# EAGLE design avr-nrf (EAGLE 6.1)
Assembly variants: no-eth
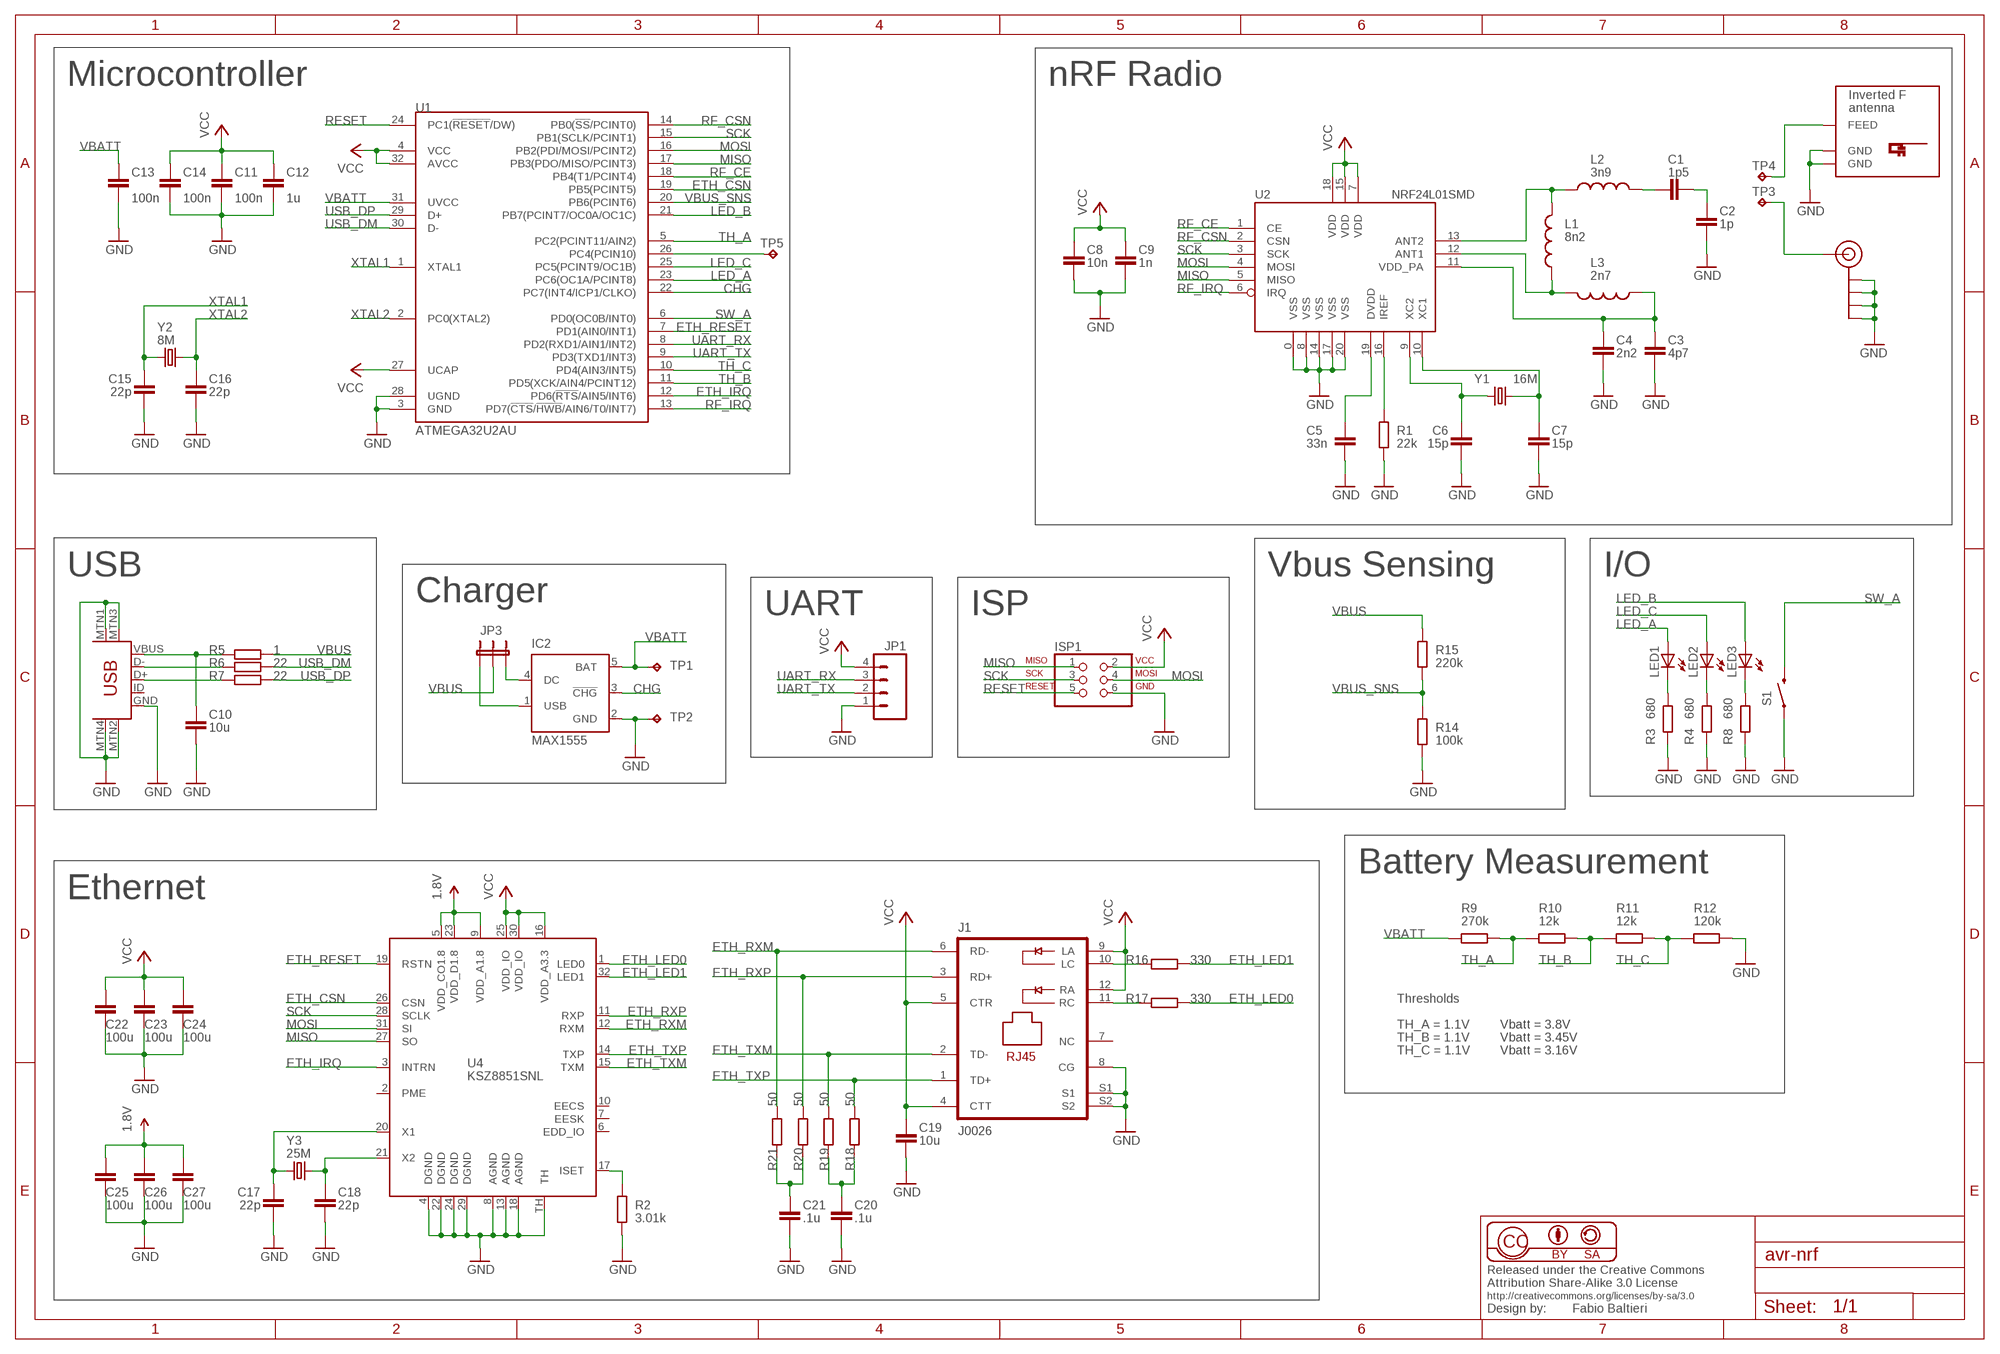
[diagram p0: schematic, sheet 1]

## Parts
C1  1p5  C-EUC0805  [C0805]
C2  1p  C-EUC0805  [C0805]
C3  4p7  C-EUC0805  [C0805]
C4  2n2  C-EUC0805  [C0805]
C5  33n  C-EUC0805  [C0805]
C6  15p  C-EUC0805  [C0805]
C7  15p  C-EUC0805  [C0805]
C8  10n  C-EUC0805  [C0805]
C9  1n  C-EUC0805  [C0805]
C10  10u  C-EUC0805  [C0805]
C11  100n  C-EUC0805  [C0805]
C12  1u  C-EUC0805  [C0805]
C13  100n  C-EUC0805  [C0805]
C14  100n  C-EUC0805  [C0805]
C15  22p  C-EUC0805  [C0805]
C16  22p  C-EUC0805  [C0805]
C17  22p  C-EUC0805  [C0805]  (not fitted in variant no-eth)
C18  22p  C-EUC0805  [C0805]  (not fitted in variant no-eth)
C19  10u  C-EUC0805  [C0805]  (not fitted in variant no-eth)
C20  .1u  C-EUC0805  [C0805]  (not fitted in variant no-eth)
C21  .1u  C-EUC0805  [C0805]  (not fitted in variant no-eth)
C22  100u  C-EUC0805  [C0805]  (not fitted in variant no-eth)
C23  100u  C-EUC0805  [C0805]  (not fitted in variant no-eth)
C24  100u  C-EUC0805  [C0805]  (not fitted in variant no-eth)
C25  100u  C-EUC0805  [C0805]  (not fitted in variant no-eth)
C26  100u  C-EUC0805  [C0805]  (not fitted in variant no-eth)
C27  100u  C-EUC0805  [C0805]  (not fitted in variant no-eth)
IC2  MAX1555  [SOT23-5L]
ISP1  ISP-AVR910PTH  [2X03]
J1  J0026  [PJ-J0]  (not fitted in variant no-eth)
J$1  SMA_EDGE  [SMA-EDGE]
JP1  M04PTH  [1X04]
JP3  JUMPER-3SMD  [SJ_3]
L1  8n2  INDUCTOR0603  [0603]
L2  3n9  INDUCTOR0603  [0603]
L3  2n7  INDUCTOR0603  [0603]
LED1  LEDCHIPLED_0805  [CHIPLED_0805]
LED2  LEDCHIPLED_0805  [CHIPLED_0805]
LED3  LEDCHIPLED_0805  [CHIPLED_0805]
R1  22k  R-EU_R0603  [R0603]
R2  3.01k  R-EU_R0603  [R0603]  (not fitted in variant no-eth)
R3  680  R-EU_R0603  [R0603]
R4  680  R-EU_R0603  [R0603]
R5  1  R-EU_R0603  [R0603]
R6  22  R-EU_R0603  [R0603]
R7  22  R-EU_R0603  [R0603]
R8  680  R-EU_R0603  [R0603]
R9  270k  R-EU_R0603  [R0603]
R10  12k  R-EU_R0603  [R0603]
R11  12k  R-EU_R0603  [R0603]
R12  120k  R-EU_R0603  [R0603]
R14  100k  R-EU_R0603  [R0603]
R15  220k  R-EU_R0603  [R0603]
R16  330  R-EU_R0603  [R0603]  (not fitted in variant no-eth)
R17  330  R-EU_R0603  [R0603]  (not fitted in variant no-eth)
R18  50  R-EU_R0603  [R0603]  (not fitted in variant no-eth)
R19  50  R-EU_R0603  [R0603]  (not fitted in variant no-eth)
R20  50  R-EU_R0603  [R0603]  (not fitted in variant no-eth)
R21  50  R-EU_R0603  [R0603]  (not fitted in variant no-eth)
S1  SWITCH-MOMENTARY-2SMD  [TACTILE_SWITCH_SMD]
TP1  TPTP12R  [TP12R]
TP2  TPTP12R  [TP12R]
TP3  TPTP08SQ  [TP08SQ]
TP4  TPTP08SQ  [TP08SQ]
TP5  TPTP06R  [TP06R]
U1  ATMEGA32U2AU  [TQFP32-08]
U2  NRF24L01SMD  [QFN20]
U3  USB-MINIB-5PIN  [USB-MINIB]
U4  KSZ8851SNL  [MLF32-TH]  (not fitted in variant no-eth)
U$1  INVERTED_F_ANTENNA+5  [DN007+5]
Y1  16M  CRYSTAL5X3  [CRYSTAL-SMD-5X3]
Y2  8M  CRYSTAL5X3  [CRYSTAL-SMD-5X3]
Y3  25M  CRYSTAL5X3  [CRYSTAL-SMD-5X3]  (not fitted in variant no-eth)

## Nets
1.8V [power]: C25.1 C26.1 C27.1 U4.5(VDD_CO1.8) U4.9(VDD_A1.8) U4.23(VDD_D1.8)
CHG: IC2.3(!CHG) U1.22(PC7(INT4/ICP1/CLKO))
ETH_CSN: U1.19(PB5(PCINT5)) U4.26(CSN)
ETH_IRQ: U1.12(PD6(!RTS!/AIN5/INT6)) U4.3(INTRN)
ETH_LED0: R17.2 U4.1(LED0)
ETH_LED1: R16.2 U4.32(LED1)
ETH_RESET: U1.7(PD1(AIN0/INT1)) U4.19(RSTN)
ETH_RXM: J1.6(RD-) R21.2 U4.12(RXM)
ETH_RXP: J1.3(RD+) R20.2 U4.11(RXP)
ETH_TXM: J1.2(TD-) R19.2 U4.15(TXM)
ETH_TXP: J1.1(TD+) R18.2 U4.14(TXP)
GND: C2.2 C3.2 C4.2 C5.2 C6.2 C7.2 C8.2 C9.2 C10.2 C11.2 C12.2 C13.2 C14.2 C15.2 C16.2 C17.2 C18.2 C19.2 C20.2 C21.2 C22.2 C23.2 C24.2 C25.2 C26.2 C27.2 IC2.2(GND) ISP1.6 J1.8(CG) J1.S1 J1.S2 J$1.GND@0(GND) J$1.GND@1(GND) J$1.GND@2(GND) J$1.GND@3(GND) JP1.1 R1.2 R2.2 R3.2 R4.2 R8.2 R12.1 R14.2 S1.1 TP2.TP U1.3(GND) U1.28(UGND) U2.0(VSS) U2.8(VSS) U2.14(VSS) U2.17(VSS) U2.20(VSS) U3.GND U3.MTN1(MTN2) U3.MTN2(MTN3) U3.MTN3(MTN1) U3.MTN4 U4.4(DGND) U4.8(AGND) U4.13(AGND) U4.18(AGND) U4.22(DGND) U4.24(DGND) U4.29(DGND) U4.TH U$1.GND U$1.GND@1(GND)
LED_A: LED1.A U1.23(PC6(OC1A/PCINT8))
LED_B: LED3.A U1.21(PB7(PCINT7/OC0A/OC1C))
LED_C: LED2.A U1.25(PC5(PCINT9/OC1B))
MISO: ISP1.1 U1.17(PB3(PDO/MISO/PCINT3)) U2.5(MISO) U4.27(SO)
MOSI: ISP1.4 U1.16(PB2(PDI/MOSI/PCINT2)) U2.4(MOSI) U4.31(SI)
N$1: L1.2 L3.2 U2.12(ANT1)
N$2: L1.1 L2.1 U2.13(ANT2)
N$3: C1.1 L2.2
N$4: C1.2 C2.1
N$5: C3.1 C4.1 L3.1 U2.11(VDD_PA)
N$6: J$1.SIG(SIGNAL) TP3.TP
N$7: C5.1 U2.19(DVDD)
N$8: R1.1 U2.16(IREF)
N$9: C7.1 U2.10(XC1) Y1.3
N$10: C6.1 U2.9(XC2) Y1.1
N$11: TP4.TP U$1.FEED
N$12: IC2.4(DC) JP3.3
N$13: R7.1 U3.D+
N$14: R6.1 U3.D-
N$15: LED1.C R3.1
N$16: IC2.1(USB) JP3.1
N$18: LED2.C R4.1
N$19: LED3.C R8.1
N$20: J1.10(LC) R16.1
N$21: J1.11(RC) R17.1
N$22: R2.1 U4.17(ISET)
N$23: C17.1 U4.20(X1) Y3.1
N$24: C18.1 U4.21(X2) Y3.3
N$25: TP5.TP U1.26(PC4(PCIN10))
N$26: C21.1 R20.1 R21.1
N$27: C20.1 R18.1 R19.1
N$30: C10.1 R5.1 U3.VBUS
RESET: ISP1.5 U1.24(PC1(!RESET!/DW))
RF_CE: U1.18(PB4(T1/PCINT4)) U2.1(CE)
RF_CSN: U1.14(PB0(!SS!/PCINT0)) U2.2(CSN)
RF_IRQ: U1.13(PD7(!CTS!/!HWB!/AIN6/T0/INT7)) U2.6(IRQ)
SCK: ISP1.3 U1.15(PB1(SCLK/PCINT1)) U2.3(SCK) U4.28(SCLK)
SW_A: S1.3 U1.6(PD0(OC0B/INT0))
TH_A: R9.1 R10.2 U1.5(PC2(PCINT11/AIN2))
TH_B: R10.1 R11.2 U1.11(PD5(XCK/AIN4/PCINT12))
TH_C: R11.1 R12.2 U1.10(PD4(AIN3/INT5))
UART_RX: JP1.3 U1.8(PD2(RXD1/AIN1/INT2))
UART_TX: JP1.2 U1.9(PD3(TXD1/INT3))
USB_DM: R6.2 U1.30(D-)
USB_DP: R7.2 U1.29(D+)
VBATT: C13.1 IC2.5(BAT) R9.2 TP1.TP U1.31(UVCC)
VBUS: JP3.2 R5.2 R15.1
VBUS_SNS: R14.1 R15.2 U1.20(PB6(PCINT6))
VCC [power]: C8.1 C9.1 C11.1 C12.1 C14.1 C19.1 C22.1 C23.1 C24.1 ISP1.2 J1.4(CTT) J1.5(CTR) J1.9(LA) J1.12(RA) JP1.4 U1.4(VCC) U1.27(UCAP) U1.32(AVCC) U2.7(VDD) U2.15(VDD) U2.18(VDD) U4.16(VDD_A3.3) U4.25(VDD_IO) U4.30(VDD_IO)
XTAL1: C15.1 U1.1(XTAL1) Y2.1
XTAL2: C16.1 U1.2(PC0(XTAL2)) Y2.3
Unconnected: J1.7(NC) U3.ID U4.2(PME) U4.6(EDD_IO) U4.7(EESK) U4.10(EECS)

## Notes on the sheet
- Microcontroller | nRF Radio
- USB | Vbus Sensing | I/O
- Charger
- UART | ISP
- Battery Measurement
- Ethernet
- Thresholds
- TH_A = 1.1V | Vbatt = 3.8V
- TH_B = 1.1V | Vbatt = 3.45V
- TH_C = 1.1V | Vbatt = 3.16V

## Library data of the parts
C1-C27 = rcl:C-EU: CAPACITOR, European symbol
IC2 = maxim:MAX1555: Dual-Input USB/AC Adapter 1-Cell Li+ Battery Chargers Source: http://www.maxim-ic.com .. MAX1551-MAX1555.pdf
ISP1 = balto:ISP-AVR910: PIN HEADER
J1 = micrel:J0026: RJ45 PulseJack w/LEDs
J$1 = SparkFun:SMA_EDGE: SMA Antenna Connector End launch SMA connector. The paste layer has been removed so that the connector can be hand soldered onto the board after reflow.
JP1 = SparkFun:M04: Header 4 Standard 4-pin 0.1" header. Use with straight break away headers (SKU : PRT-00116), right angle break away headers (PRT-00553), swiss pins (PRT-00743), machine pins (PRT-00117), and female headers (PRT-00115). Molex polarized connector foot print use with SKU : PRT-08231 with associated crimp pins and housings. 1MM SMD Version SKU: PRT-10208
JP3 = SparkFun:JUMPER-3
L1-L3 = SparkFun:INDUCTOR: Inductors Basic Inductor/Choke - 0603 and 1206. Footprints are not proven and vary greatly between part numbers.
LED1-LED3 = led:LED: LED OSRAM: - CHIPLED LG R971, LG N971, LY N971, LG Q971, LY Q971, LO R971, LY R971 LH N974, LH R974 LS Q976, LO Q976, LY Q976 LO Q996 - Hyper CHIPLED LW Q18S LB Q993, LB Q99A, LB R99A - SideLED LS A670, LO A670, LY A670, LG A670, LP A670 LB A673, LV A673, LT A673, LW A673 LH A674 LY A675 LS A676, LA A676, LO A676, LY A676, LW A676 LS A679, LY A679, LG A679 - Hyper Micro SIDELED® LS Y876, LA Y876, LO Y876, LY Y876 LT Y87S - SmartLED LW L88C, LW L88S LB L89C, LB L89S, LG L890 LS L89K, LO L89K, LY L89K LS L896, LA L896, LO L896, LY L896 - TOPLED LS T670, LO T670, LY T670, LG T670, LP T670 LSG T670, LSP T670, LSY T670, LOP T670, LYG T670 LG T671, LOG T671, LSG T671 LB T673, LV T673, LT T673, LW T673 LH T674 LS T676, LA T676, LO T676, LY T676, LB T676, LH T676, LSB T676, LW T676 LB T67C, LV T67C, LT T67C, LS T67K, LO T67K, LY T67K, LW E67C LS E67B, LA E67B, LO E67B, LY E67B, LB E67C, LV E67C, LT E67C LW T67C LS T679, LY T679, LG T679 LS T770, LO T770, LY T770, LG T770, LP T770 LB T773, LV T773, LT T773, LW T773 LH T774 LS E675, LA E675, LY E675, LS T675 LS T776, LA T776, LO T776, LY T776, LB T776 LHGB T686 LT T68C, LB T68C - Hyper Mini TOPLED® LB M676 - Mini TOPLED Santana® LG M470 LS M47K, LO M47K, LY M47K Source: http://www.osram.convergy.de LUXEON: - LUMILED® LXK2-PW12-R00, LXK2-PW12-S00, LXK2-PW14-U00, LXK2-PW14-V00 LXK2-PM12-R00, LXK2-PM12-S00, LXK2-PM14-U00 LXK2-PE12-Q00, LXK2-PE12-R00, LXK2-PE12-S00, LXK2-PE14-T00, LXK2-PE14-U00 LXK2-PB12-K00, LXK2-PB12-L00, LXK2-PB12-M00, LXK2-PB14-N00, LXK2-PB14-P00, LXK2-PB14-Q00 LXK2-PR12-L00, LXK2-PR12-M00, LXK2-PR14-Q00, LXK2-PR14-R00 LXK2-PD12-Q00, LXK2-PD12-R00, LXK2-PD12-S00 LXK2-PH12-R00, LXK2-PH12-S00 LXK2-PL12-P00, LXK2-PL12-Q00, LXK2-PL12-R00 Source: www.luxeon.com KINGBRIGHT: KA-3528ASYC Source: www.kingbright.com
R1-R12 R14-R21 = rcl:R-EU_: RESISTOR, European symbol
S1 = SparkFun:SWITCH-MOMENTARY-2
TP1-TP5 = testpad:TP: Test pad
U1 = balto:ATMEGA32U2: Atmel 8-bit Microcontroller with 8/16/32K Bystes of ISP Flash and USB Controller. ATmega8U2, ATmega16U2, and ATmega32U2
U2 = SparkFun:NRF24L01: 2.4GHz Low Power Transceiver This is the very popular, low cost, very low power RF transceiver from Nordic Semiconductor. Simple SPI interface. SKU: COM-00690
U3 = SparkFun:USB-MINIB: Mini-USB "B" connector with 5th pin broken out. Created new symbol breaking out 5th "ID" pin in mini/micro USB connector spec. See: http://en.wikipedia.org/wiki/Mini_usb#Cables. Uses same footprint as 4-pin symbol. Also added pins to connect to mounting / shield pads if required (probably not generally needed as signals aren't shielded once they leave the connector).
U4 = balto:KSZ8851SNL: KSZ8851SNL/SNLI
U$1 = antenna:INVERTED_F_ANTENNA: 2.4GHz Inverted F Antenna Based on TI Design Note DN007
Y1-Y3 = SparkFun:CRYSTAL: Crystals Various standard crystals. Proven footprints. Spark Fun Electronics SKU : COM-00534

## Net classes
1 power: width 0.254 mm

## Board
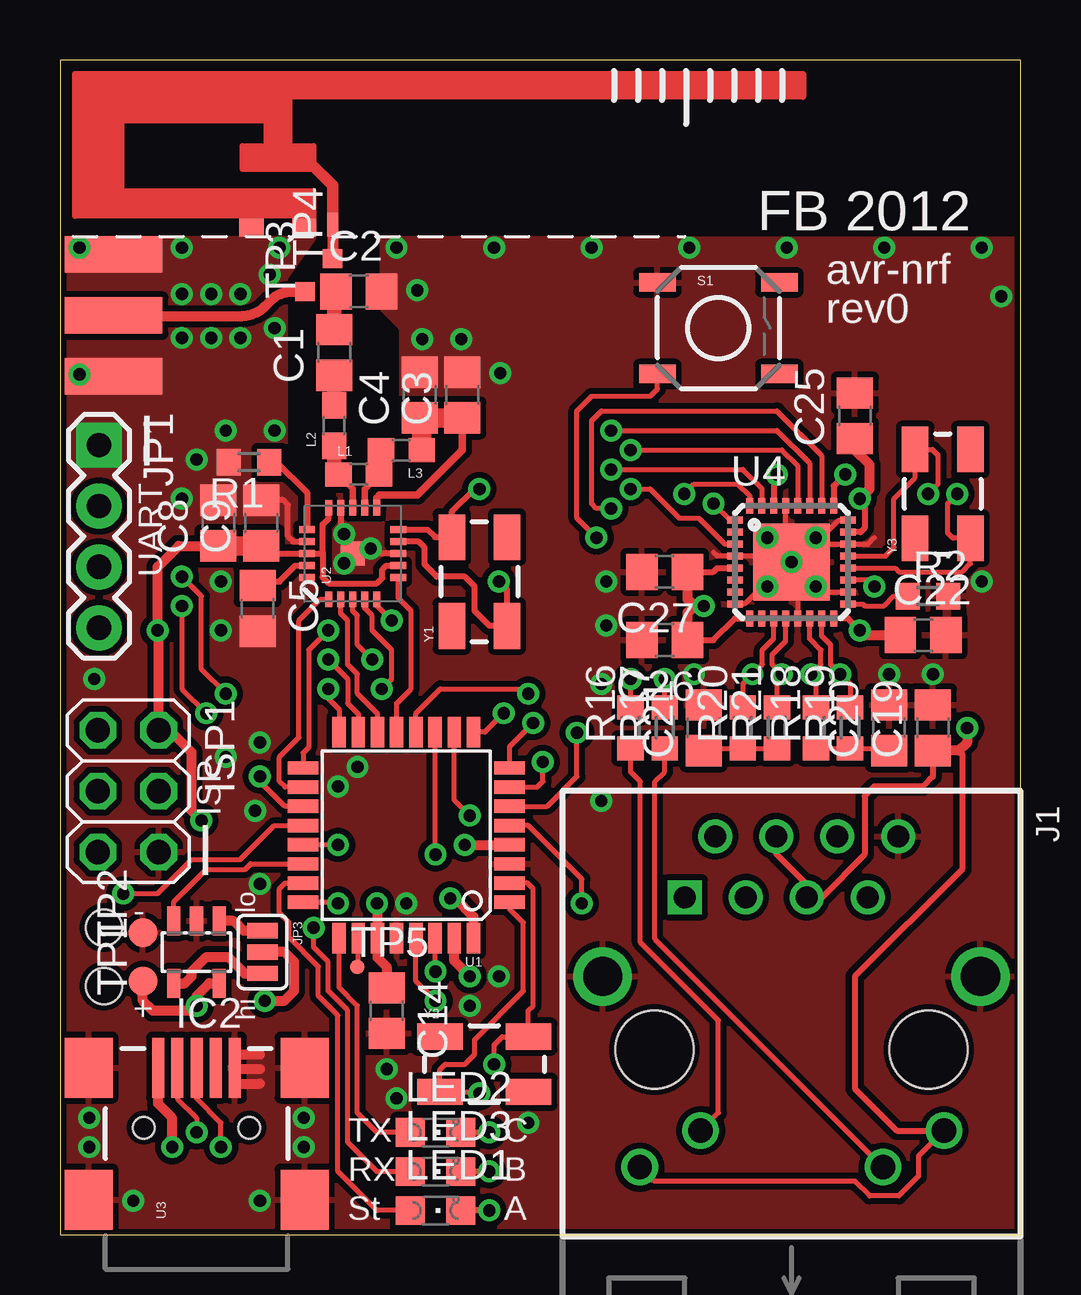
[diagram p1: board, top side]
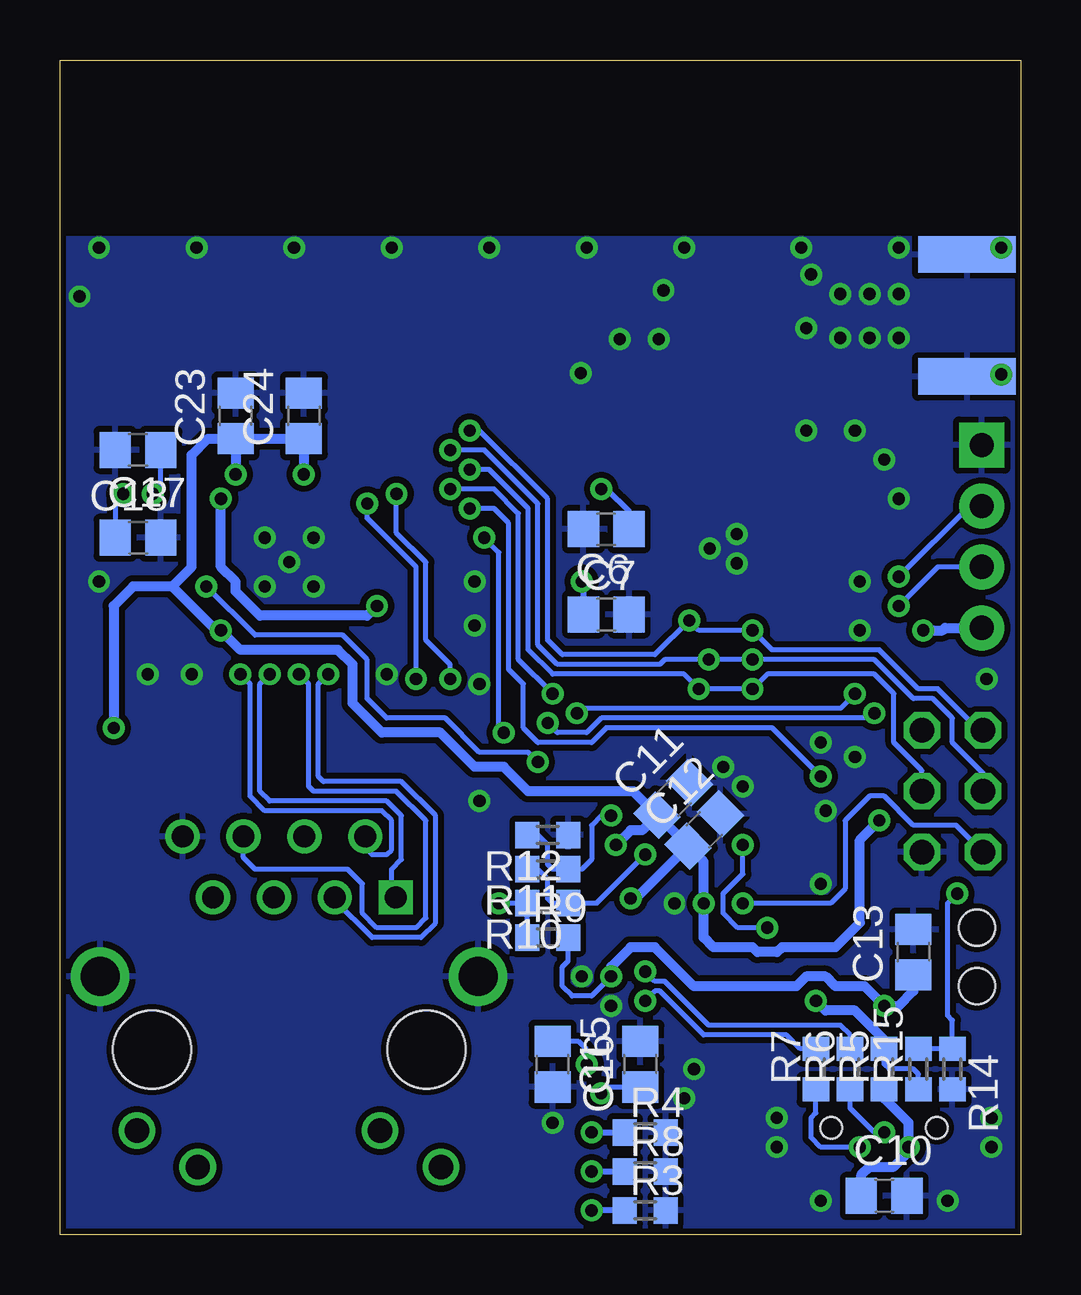
[diagram p2: board, bottom side, seen from below]

Size 40.03 x 48.97 mm. Coordinates in mm from the lower left corner, seen from the top.
Outline: 40.03,0 40.03,48.97 0,48.97 0,0 40.03,0
Copper layers (1*16): Top 0.035mm / dielectric 1.5mm / Bottom 0.035mm
Design rules: minimum track width 8mil, minimum drill 20mil, track to track 8mil, track to pad 8mil, pad to pad 8mil, via to via 8mil, smd to smd 8mil, copper to edge 10mil, drill to drill 8mil, minimum pad ring 10mil, minimum via ring 8mil, stop-mask expansion 4mil, vias tented up to drill 20mil, thermal gap 10mil
Holes 1.5 mm at 1.83,12.8 1.83,10.36

### Footprints (pad centres in the part's own frame; a part is rotated, then mirrored left to right if it is on the bottom)
C0805 = smd 1.3 x 1.5: 1 -0.95,0; 2 0.95,0
SOT23-5L = smd 0.55 x 1.2: 1 -0.95,-1.3; 2 0,-1.3; 3 0.95,-1.3; 4 0.95,1.3; 5 -0.95,1.3
2X03 = drill 1.016 octagon: 1 -2.54,-1.27; 2 -2.54,1.27; 3 0,-1.27; 4 0,1.27; 5 2.54,-1.27; 6 2.54,1.27
PJ-J0 = drill 0.914 square: 1 4.445,-6.35 | drill 0.914: 2 3.175,-8.89; 3 1.905,-6.35; 4 0.635,-8.89; 5 -0.635,-6.35; 6 -1.905,-8.89; 7 -3.175,-6.35; 8 -4.445,-8.89 | drill 1.016: 9 6.325,4.902; 10 3.785,3.378; 11 -3.81,4.902; 12 -6.35,3.378 | drill 1.626: S1 -7.874,-3.048; S2 7.874,-3.048 | hole 3.251: -5.715,0; 5.715,0
SMA-EDGE = smd 1.524 x 4.064: GND@0 0,0; GND@1 5.08,0; SIG 2.54,0 | smd 1.524 x 4.064 bottom: GND@2 0,0; GND@3 5.08,0
1X04 = drill 1.016 pad 1.88 square: 1 0,0 | drill 1.016 pad 1.88: 2 2.54,0; 3 5.08,0; 4 7.62,0
SJ_3 = smd 0.635 x 1.27: 1 -0.889,0; 2 0,0; 3 0.889,0
0603 = smd 1.1 x 1: 1 -0.85,0; 2 0.85,0
CHIPLED_0805 = smd 1.2 x 1.2: A 0,-1.05; C 0,1.05
R0603 = smd 1 x 1.1: 1 -0.85,0; 2 0.85,0
TACTILE_SWITCH_SMD = smd 1.524 x 0.762: 1 -2.54,1.905; 2 2.54,1.905; 3 -2.54,-1.905; 4 2.54,-1.905
TP12R = smd 1.2 x 1.2: TP 0,0
TP08SQ = smd 0.8 x 0.8: TP 0,0
TP06R = smd 0.6 x 0.6: TP 0,0
TQFP32-08 = smd 1.27 x 0.559: 1 -4.293,2.8; 2 -4.293,2; 3 -4.293,1.2; 4 -4.293,0.4; 5 -4.293,-0.4; 6 -4.293,-1.2; 7 -4.293,-2; 8 -4.293,-2.8; 17 4.293,-2.8; 18 4.293,-2; 19 4.293,-1.2; 20 4.293,-0.4; 21 4.293,0.4; 22 4.293,1.2; 23 4.293,2; 24 4.293,2.8 | smd 0.559 x 1.27: 9 -2.8,-4.293; 10 -2,-4.293; 11 -1.2,-4.293; 12 -0.4,-4.293; 13 0.4,-4.293; 14 1.2,-4.293; 15 2,-4.293; 16 2.8,-4.293; 25 2.8,4.293; 26 2,4.293; 27 1.2,4.293; 28 0.4,4.293; 29 -0.4,4.293; 30 -1.2,4.293; 31 -2,4.293; 32 -2.8,4.293
QFN20 = smd 1 x 1: 0 0,0 | smd 0.65 x 0.29: 1 -1.9,1; 2 -1.9,0.5; 3 -1.9,0; 4 -1.9,-0.5; 5 -1.9,-1; 11 1.9,-1; 12 1.9,-0.5; 13 1.9,0; 14 1.9,0.5; 15 1.9,1 | smd 0.29 x 0.65: 6 -1,-1.9; 7 -0.5,-1.9; 8 0,-1.9; 9 0.5,-1.9; 10 1,-1.9; 16 1,1.9; 17 0.5,1.9; 18 0,1.9; 19 -0.5,1.9; 20 -1,1.9
USB-MINIB = smd 2.5 x 0.5: D+ 2.5,0; D- 2.5,0.8; GND 2.5,-1.6; ID 2.5,-0.8; VBUS 2.5,1.6 | smd 2.5 x 2: MTN1 -3,4.5; MTN2 2.5,4.5; MTN3 -3,-4.5; MTN4 2.5,-4.5 | hole 0.9: 0,2.2; 0,-2.2
MLF32-TH = smd 0.65 x 0.29: 1 -2.35,1.75; 2 -2.35,1.25; 3 -2.35,0.75; 4 -2.35,0.25; 5 -2.35,-0.25; 6 -2.35,-0.75; 7 -2.35,-1.25; 8 -2.35,-1.75; 17 2.35,-1.75; 18 2.35,-1.25; 19 2.35,-0.75; 20 2.35,-0.25; 21 2.35,0.25; 22 2.35,0.75; 23 2.35,1.25; 24 2.35,1.75 | smd 0.29 x 0.65: 9 -1.75,-2.35; 10 -1.25,-2.35; 11 -0.75,-2.35; 12 -0.25,-2.35; 13 0.25,-2.35; 14 0.75,-2.35; 15 1.25,-2.35; 16 1.75,-2.35; 25 1.75,2.35; 26 1.25,2.35; 27 0.75,2.35; 28 0.25,2.35; 29 -0.25,2.35; 30 -0.75,2.35; 31 -1.25,2.35; 32 -1.75,2.35 | smd 3.2 x 3.2: TH 0,0
DN007+5 = smd 0.46 x 1: FEED 2.22,-2.8 | smd 1.01 x 0.74: GND -1.16,-2.93; GND@1 1.035,-2.93
CRYSTAL-SMD-5X3 = smd 1.9 x 1.1: 1 -1.85,-1.15; 2 1.85,-1.15; 3 1.85,1.15; 4 -1.85,1.15

### Placement (x,y rotation side)
C1  11.43,36.78 90 top
C2  12.45,39.32 0 top
C3  16.76,35 90 top
C4  14.99,35 90 top
C5  8.23,26.11 270 top
C6  17.27,25.86 0 bottom
C7  17.27,29.41 180 bottom
C8  6.6,29.67 90 top
C9  8.38,29.67 90 top
C10  5.69,1.63 0 bottom
C11  14.48,18.17 45 bottom
C12  13.18,16.88 45 bottom
C13  4.47,11.79 90 bottom
C14  13.61,9.35 270 top
C15  15.85,7.11 90 bottom
C16  19.51,7.11 270 bottom
C17  36.78,29.06 0 bottom
C18  36.78,32.72 180 bottom
C19  36.37,21.13 90 top
C20  34.54,21.13 90 top
C21  26.82,21.13 90 top
C22  35.97,24.99 0 top
C23  32.72,34.14 90 bottom
C24  29.87,34.14 90 bottom
C25  33.12,34.14 90 top
C26  25.2,24.79 180 top
C27  25.2,27.64 180 top
IC2  5.69,11.79 180 top
ISP1  2.84,18.49 270 top
J1  30.48,7.72 180 top
J$1  2.24,35.78 90 top
JP1  1.63,32.92 270 top
JP3  8.43,11.79 270 top
L1  12.45,31.7 0 top
L2  11.43,33.73 90 top
L3  14.22,32.72 180 top
LED1  15.65,1.02 270 top
LED2  15.65,4.27 270 top
LED3  15.65,2.64 270 top
R1  7.87,32.21 180 top
R2  36.17,26.62 0 top
R3  15.65,1.02 0 bottom
R4  15.65,4.27 0 bottom
R5  5.69,6.91 90 bottom
R6  7.11,6.91 90 bottom
R7  8.53,6.91 90 bottom
R8  15.65,2.64 0 bottom
R9  19.71,12.4 0 bottom
R10  19.71,13.82 180 bottom
R11  19.71,15.24 180 bottom
R12  19.71,16.66 180 bottom
R14  2.84,6.91 270 bottom
R15  4.27,6.91 90 bottom
R16  23.77,21.13 90 top
R17  25.2,21.13 90 top
R18  31.5,21.13 90 top
R19  32.92,21.13 90 top
R20  28.45,21.13 90 top
R21  29.87,21.13 90 top
S1  27.43,37.8 0 top
TP1  3.45,10.57 90 top
TP2  3.45,12.6 90 top
TP3  10.21,39.32 90 top
TP4  11.35,40.69 90 top
TP5  12.4,11.18 0 top
U1  14.43,16.66 180 top
U2  12.19,28.4 90 top
U3  5.69,4.47 90 top
U4  30.48,28.04 0 top
U$1  9.14,44.91 0 top
Y1  17.48,27.23 90 top
Y2  17.68,7.11 0 top
Y3  36.78,30.89 90 top

### Tracks (layer width: path | path; a pad name or v marks a point on that pad's centre or on a via)
1.8V  (via drill 0.51)
  Top 0.254: U4.23 33.36,29.29 33.53,29.46 33.53,30.48 v33.33,30.68 | C27.1 27.23,27.64 27.39,27.79 U4.5 | U4.9 28.13,25.69 27.23,24.79 C26.1
  Top 0.406: v33.33,30.68 33.73,31.09 33.73,32.11 33.12,32.72 C25.1 | 26.42,26.21 v26.82,26.21 | C27.1 26.15,26.48 26.42,26.21 | C26.1 26.15,25.94 26.42,26.21
  Bottom 0.406: v33.33,30.68 33.33,27.84 32.72,27.23 32.72,26.82 31.7,25.81 27.23,25.81 v26.82,26.21
CHG
  Top 0.203: U1.22 7.94,15.46 7.72,15.24 6.1,15.24 4.74,13.88 IC2.3
ETH_CSN  (via drill 0.51)
  Top 0.203: U4.26 31.73,32.48 29.87,34.34 22.55,34.34 22.15,33.93 22.15,30.48 22.35,30.28 v22.96,30.28 | U1.19 9.37,17.86 8.33,18.9 v8.33,19.1
  Bottom 0.203: v22.96,30.28 21.95,30.28 21.34,29.67 21.34,23.57 20.73,22.96 20.73,21.13 20.12,20.52 17.88,20.52 17.27,21.13 10.36,21.13 v8.33,19.1
ETH_IRQ  (via drill 0.51)
  Top 0.203: U1.12 14.83,21.74 15.85,22.76 19.3,22.76 v19.51,22.55 | U4.3 27.7,28.79 26.62,29.87 25.81,29.87 24.59,31.09 v23.77,31.09
  Bottom 0.203: v19.51,22.55 20.93,23.98 20.93,30.07 21.95,31.09 v23.77,31.09
ETH_LED0  (via drill 0.51)
  Top 0.203: R17.2 v25.2,23.16 | U4.1 27.92,29.79 v27.23,30.48
  Bottom 0.203: v25.2,23.16 25.2,27.84 27.23,29.87 v27.23,30.48
ETH_LED1  (via drill 0.51)
  Top 0.203: R16.2 v23.77,23.16 | 28.73,30.6 U4.32 28.73,30.81 28.25,31.29 26.42,31.29 v26.01,30.89
  Bottom 0.203: v23.77,23.16 23.77,23.77 24.79,24.79 24.79,28.04 26.01,29.26 v26.01,30.89
ETH_RESET  (via drill 0.51)
  Top 0.203: U4.19 33.67,27.29 v33.93,27.03 | U1.7 19.88,18.66 20.12,18.9 v20.12,19.71
  Bottom 0.203: v20.12,19.71 20.52,20.12 22.55,20.12 23.98,21.54 26.42,21.54 27.23,22.35 27.23,23.98 28.25,24.99 31.9,24.99 v33.93,27.03
ETH_RXM  (via drill 0.51)
  Top 0.203: U4.12 30.23,24.74 29.67,24.18 29.67,23.77 v30.07,23.37 29.87,23.16 R21.2
  Bottom 0.203: v30.07,23.37 29.67,22.96 29.67,18.69 29.46,18.49 26.01,18.49 24.79,17.27 24.79,13.21 25.2,12.8 26.82,12.8 27.43,13.41 27.43,14.63 28.04,15.24 31.9,15.24 32.38,15.72 J1.6
ETH_RXP  (via drill 0.51)
  Top 0.203: U4.11 29.73,24.85 29.26,24.38 29.26,23.77 v28.85,23.37 28.45,22.96 R20.2
  Bottom 0.203: v28.85,23.37 29.26,22.96 29.26,19.1 29.06,18.9 25.81,18.9 24.38,17.48 24.38,13.01 24.99,12.39 27.03,12.39 28.57,13.95 J1.3
ETH_TXM  (via drill 0.51)
  Top 0.203: U4.15 31.73,24.96 32.11,24.59 32.11,23.77 v32.51,23.37 | v32.51,23.37 32.72,23.16 | R19.2 32.92,22.96 v32.51,23.37
  Bottom 0.203: v32.51,23.37 32.11,22.96 32.11,18.29 31.5,17.68 26.62,17.68 26.21,17.27 26.21,16.05 26.42,15.85 27.03,15.85 27.3,16.13 J1.2
ETH_TXP  (via drill 0.51)
  Top 0.203: U4.14 31.23,24.85 31.7,24.38 31.7,23.77 v31.29,23.37 31.5,23.16 R18.2
  Bottom 0.203: v31.29,23.37 31.7,22.96 31.7,18.49 31.29,18.09 26.42,18.09 25.81,17.48 25.81,15.65 26.21,15.24 26.21,14.25 J1.1
GND  (via drill 0.51)
  Top 0.203: 29.87,28.29 30.23,28.29 | 29.87,28.29 U4.4 27.39,28.29 27.23,28.45 | U4.13 30.73,27.79 U4.TH | 30.23,28.29 U4.29 | 30.23,28.29 U4.TH | U4.18 31.73,26.79 v31.5,27.03 U4.TH | U4.24 32.54,29.79 arc45 32.36,29.72 31.9,29.26 31.7,29.26 v31.5,29.06 U4.TH | U4.TH 31.23,28.79 U4.22 33.67,28.79 33.93,29.06 | 29.26,27.03 29.26,27.68 29.87,28.29 | 29.26,27.03 29.16,27.03 | 29.26,26.82 v29.46,27.03 29.26,27.03 | U4.8 28.42,26.29 arc45 28.6,26.37 29.26,27.03
  Top 0.254: U2.14 11.69,29.35 v11.84,29.21 | U2.8 13.16,28.4 v12.95,28.6 | U2.17 9.71,28.9 9.5,29.11 9.5,30.43 9.31,30.62 C9.2
  Top 0.406: 7.32,6.91 8.33,6.91 | 7.32,7.52 8.33,7.52 | 7.32,6.3 8.33,6.3
  other vias: 11.84,27.99 30.48,28.04 34.54,23.37 22.76,27.23 29.46,29.06 36.37,23.37 38.4,27.23 26.42,23.37 5.08,39.22 5.08,37.39 3.05,1.42 8.33,1.42 14.88,39.37 10.16,4.88 1.22,4.88 5.08,30.68 6.71,27.23 5.69,32.31 6.91,33.53 12.4,19.51 14.43,13.82 8.33,20.52 13.61,6.91 14.02,5.69 19.51,4.67 18.29,10.77 10.16,3.66 1.22,3.66 22.76,25.4 17.07,9.55 6.3,39.22 7.52,39.22 6.3,37.39 7.52,37.39 8.94,37.8 8.74,40.03 15.09,37.34 16.71,37.34 18.34,35.92 1.42,23.16 22.56,18.08 11.58,18.69 8.33,14.63 8.13,17.68 6.91,19.91 6.71,25.2 22.56,22.96 5.08,41.15 9.14,41.15 14.02,41.15 18.08,41.15 22.15,41.15 26.21,41.15 30.28,41.15 34.34,41.15 38.4,41.15 0.81,41.15 0.81,35.86 39.22,39.12 8.94,33.53
  pour Top (isolate 0.254, no thermals): 20.93,23.98 20.93,41.53 13.41,41.53 13.41,38.61 14.22,37.8 14.22,31.19 9.4,31.19 9.4,39.88 10.58,41.53 10.58,41.63 9.78,41.63 9.78,41.53 8.38,41.53 8.38,41.71 7.59,41.71 7.59,41.53 0,41.53 0,23.98
  pour Top (isolate 0.254, no thermals): 11.43,27.64 11.43,29.16 12.95,29.16 12.95,27.64
  pour Bottom (isolate 0.254): 0,0 0,41.53 40.03,41.53 40.03,0
  pour Top (isolate 0.254): 0,0 0,24.99 20.32,24.99 20.32,41.53 40.03,41.53 40.03,0
LED_A
  Top 0.203: U1.23 9.38,14.66 9.14,14.43 9.14,13.41 9.55,13.01 9.55,12.39 10.77,11.18 10.77,9.96 11.58,9.14 11.58,2.64 13.21,1.02 LED1.A
LED_B  (via drill 0.51)
  Top 0.203: U1.21 v11.58,16.26 | v10.57,12.8 10.57,11.99 11.18,11.38 11.18,10.16 11.99,9.35 11.99,3.86 13.21,2.64 LED3.A
  Bottom 0.203: v11.58,16.26 11.58,15.04 12.39,14.22 12.39,13.41 11.79,12.8 v10.57,12.8
LED_C
  Top 0.203: U1.25 11.63,10.32 12.39,9.55 12.39,5.08 13.21,4.27 LED2.A
MISO  (via drill 0.51)
  Top 0.203: v11.18,25.2 10.36,24.38 10.36,20.32 10.13,20.09 U1.17 | U2.5 13.19,26.23 v13.82,25.6 | U4.27 31.23,32.17 29.87,33.53 v22.96,33.53
  Bottom 0.203: v22.96,33.53 22.55,33.53 19.71,30.68 19.71,24.79 19.1,24.18 15.24,24.18 v13.82,25.6 13.41,25.2 v11.18,25.2 10.36,24.38 5.89,24.38 4.27,22.76 3.45,22.76 1.73,21.03 ISP1.1
MOSI  (via drill 0.51)
  Top 0.203: U2.4 12.69,26.12 13.01,25.81 13.01,25.2 13.82,24.38 13.82,23.16 v13.41,22.76 | v11.18,22.76 11.18,22.35 11.63,21.9 U1.16 | U4.31 29.23,31.12 28.45,31.9 v22.96,31.9
  Bottom 0.203: ISP1.4 4.12,19.36 5.28,20.52 5.28,22.55 6.1,23.37 10.57,23.37 v11.18,22.76 v13.41,22.76 14.02,23.37 19.51,23.37 20.52,24.38 20.52,30.28 22.15,31.9 v22.96,31.9
N$1
  Top 0.279: U2.12 12.69,31.09 L1.2
  Top 0.61: L1.2 13.3,32.64 L3.2
N$2
  Top 0.279: U2.13 12.19,31.1 L1.1
  Top 0.61: L2.1 11.43,31.86 L1.1
N$3
  Top 0.61: L2.2 C1.1
N$4
  Top 0.61: C1.2 11.43,39.25 C2.1
N$5
  Top 0.305: C3.1 16.76,32.72 14.88,30.84 13.31,30.84 13.19,30.72 U2.11
  Top 0.813: C3.1 C4.1 15.07,33.96 L3.1
N$6
  Top 0.406: TP3.TP 9.67,39.32 arc45 8.77,38.95 8.5,38.67 arc-45 7.6,38.3 2.25,38.3 J$1.SIG
N$7
  Top 0.254: U2.19 9.81,27.9 9.14,27.23 8.4,27.23 C5.1
N$8
  Top 0.254: U2.16 10.29,30.93 9.02,32.21 R1.1
N$9  (via drill 0.51)
  Top 0.254: U2.10 15.31,29.4 15.62,29.08 Y1.3 16.32,30.14 17.27,31.09 v17.48,31.09
  Bottom 0.254: C7.1 16.32,30.14 17.27,31.09 v17.48,31.09
N$10  (via drill 0.51)
  Top 0.254: U2.9 14.94,28.9 15.19,28.65 15.19,27.94 15.7,27.43 16.87,27.43 17.27,27.03 17.27,26.01 17.9,25.38 Y1.1 18.62,26.89 v18.29,27.23
  Bottom 0.254: C6.1 18.22,27.16 v18.29,27.23
N$11
  Top 0.46: U$1.FEED 11.36,40.7
  Top 0.47: 11.36,40.7 TP4.TP
N$12
  Top 0.406: JP3.3 7.7,10.9 7.01,11.58 6.1,11.58 5.49,10.97 5.49,10.77 5.2,10.49 IC2.4
N$13  (via drill 0.51)
  Top 0.203: v6.71,3.66 6.71,4.67 5.69,5.69 U3.D+
  Bottom 0.203: 8.53,5.69 R7.1 8.53,5.08 8.74,4.88 8.74,4.06 8.33,3.66 v6.71,3.66
N$14  (via drill 0.51)
  Top 0.203: U3.D- 4.89,5.68 5.69,4.88 v5.69,4.27
  Bottom 0.203: v5.69,4.27 6.1,4.27 7.11,5.28 R6.1
N$15  (via drill 0.51)
  Top 0.254: v17.88,1.02 LED1.C
  Bottom 0.254: R3.1 v17.88,1.02
N$16
  Top 0.406: JP3.1 7.64,12.68 7.23,13.09 IC2.1
N$18  (via drill 0.51)
  Top 0.254: LED2.C v17.88,4.27
  Bottom 0.254: v17.88,4.27 R4.1
N$19  (via drill 0.51)
  Top 0.254: LED3.C v17.88,2.64
  Bottom 0.254: v17.88,2.64 R8.1
N$20
  Top 0.203: R16.1 23.77,19.3 24.18,18.9 24.18,12.19 27.43,8.94 27.43,5.08 J1.10
N$21
  Top 0.203: R17.1 25.2,19.3 24.79,18.9 24.79,12.32 J1.11
N$22
  Top 0.203: R2.1 34.75,26.62 34.34,26.21 33.53,26.21 33.45,26.29 U4.17
N$23  (via drill 0.51)
  Top 0.203: U4.20 34.79,27.79 34.95,27.64 37.59,27.64 37.93,27.97 Y3.1 37.21,29.04 36.98,29.26 36.98,30.48 v37.39,30.89
  Bottom 0.203: C17.1 37.73,30.55 v37.39,30.89
N$24  (via drill 0.51)
  Top 0.203: U4.21 34.39,28.29 34.75,28.65 34.75,30.68 35.63,31.57 Y3.3 36.35,32.74 36.58,32.51 36.58,31.29 v36.17,30.89
  Bottom 0.203: C18.1 35.83,31.23 v36.17,30.89
N$25
  Top 0.203: U1.26 12.43,11.21 TP5.TP
N$26
  Top 0.203: R21.1 R20.1 26.92,20.28 C21.1
N$27
  Top 0.203: R19.1 R18.1 34.44,20.28 C20.1
N$30  (via drill 0.51)
  Top 0.406: U3.VBUS 4.09,5.46 4.67,4.88 v4.67,3.66
  Bottom 0.406: R5.1 5.69,5.69 4.67,4.67 v4.67,3.66 4.67,3.45 5.28,2.85 6.3,2.85 6.64,2.5 C10.1
RESET  (via drill 0.51)
  Top 0.203: U1.24 11.54,13.86 v11.58,13.82
  Bottom 0.203: ISP1.5 2.69,17.07 4.47,17.07 5.69,18.29 6.3,18.29 7.32,17.27 7.32,14.43 7.92,13.82 v11.58,13.82
RF_CE
  Top 0.203: U2.1 10.85,26.5 9.96,25.6 9.96,20.73 9.14,19.91 9.14,18.9 9.38,18.66 U1.18
RF_CSN
  Top 0.203: U2.2 11.69,25.9 11.99,25.6 11.99,23.77 12.39,23.37 12.39,22.55 13.23,21.72 U1.14
RF_IRQ
  Top 0.203: U2.6 14.09,26.55 14.63,26.01 14.63,22.76 14.03,22.16 U1.13
SCK  (via drill 0.51)
  Top 0.203: v11.18,23.98 11.99,23.16 11.99,22.15 12.43,21.71 U1.15 | U2.3 12.19,26.01 12.39,25.81 12.39,24.59 v13.01,23.98 | U4.28 30.73,32.06 30.07,32.72 v23.77,32.72
  Bottom 0.203: ISP1.3 1.57,19.25 2.85,20.52 2.85,21.54 3.66,22.35 4.47,22.35 6.1,23.98 v11.18,23.98 v13.01,23.98 14.83,23.98 15.04,23.77 19.3,23.77 20.12,24.59 20.12,30.48 22.35,32.72 v23.77,32.72
SW_A  (via drill 0.51)
  Top 0.203: v22.35,29.06 21.54,29.87 21.54,34.34 22.15,34.95 24.59,34.95 24.89,35.26 S1.3 | v21.54,20.93 21.54,19.1 20.3,17.86 U1.6
  Bottom 0.203: v22.35,29.06 21.74,28.45 21.74,21.13 v21.54,20.93
TH_A  (via drill 0.51)
  Top 0.203: U1.5 19.51,17.06 21.74,14.83 v21.74,13.82
  Bottom 0.203: R9.1 R10.2 v21.74,13.82
TH_B  (via drill 0.51)
  Top 0.203: U1.11 15.63,15.87 v15.65,15.85
  Bottom 0.203: R11.2 20.12,15.24 19.71,14.83 19.71,14.02 19.51,13.82 R10.1 17.68,13.82 v15.65,15.85
TH_C  (via drill 0.51)
  Top 0.203: U1.10 16.43,18.12 v17.07,17.48
  Bottom 0.203: v17.07,17.48 17.48,17.48 17.88,17.07 17.88,15.65 18.29,15.24 R11.1 19.51,15.24 19.71,15.44 19.71,16.26 20.12,16.66 R12.2
UART_RX  (via drill 0.51)
  Top 0.203: v5.08,26.21 5.08,22.76 v6.1,21.74 | U1.8 18.72,20.34 v19.71,21.34
  Bottom 0.203: v6.1,21.74 6.3,21.54 17.48,21.54 18.09,20.93 19.3,20.93 v19.71,21.34 | JP1.3 3.45,27.84 v5.08,26.21
UART_TX  (via drill 0.51)
  Top 0.203: v5.08,27.43 5.89,26.62 5.89,23.57 v6.91,22.55 | U1.9 17.7,20.95 v18.49,21.74
  Bottom 0.203: v6.91,22.55 7.52,21.95 18.29,21.95 v18.49,21.74 | v5.08,27.43 2.13,30.38 JP1.2
USB_DM  (via drill 0.51)
  Top 0.203: U1.30 15.63,10.99 v15.65,10.97
  Bottom 0.203: R6.2 7.11,8.33 7.52,8.74 13.01,8.74 14.83,10.57 15.24,10.57 v15.65,10.97
USB_DP  (via drill 0.51)
  Top 0.203: U1.29 14.83,10.57 v15.65,9.75
  Bottom 0.203: v15.65,9.75 15.24,10.16 15.04,10.16 13.21,8.33 9.75,8.33 9.18,7.76 R7.2
VBATT  (via drill 0.51)
  Top 0.406: IC2.5 6.22,10.49 5.69,9.96 v5.69,9.55 5.49,9.35 3.86,9.35 3.45,9.75 TP1.TP | U1.31 16.43,11.41 v17.07,10.77
  Bottom 0.203: v17.07,10.77 17.88,9.96 18.69,9.96 19.1,10.36 19.1,11.18 18.86,11.42 R9.2
  Bottom 0.406: C13.1 4.47,10.16 5.08,9.55 v5.69,9.55 6.5,10.36 7.72,10.36 8.13,10.77 8.94,10.77 9.35,10.36 13.61,10.36 15.24,11.99 16.26,11.99 17.07,11.18 v17.07,10.77
VBUS  (via drill 0.51)
  Top 0.406: JP3.2 9.35,11.79 9.75,11.38 9.75,10.16 9.35,9.75 v8.53,9.75
  Bottom 0.203: R15.1 4.27,6.71 4.47,6.91 5.49,6.91 5.69,7.11 R5.2
  Bottom 0.406: R5.2 5.69,8.13 6.91,9.35 8.13,9.35 v8.53,9.75
VBUS_SNS  (via drill 0.51)
  Top 0.203: U1.20 8.93,17.06 7.52,15.65 5.49,15.65 4.06,14.22 v2.64,14.22
  Bottom 0.203: R15.2 R14.1 2.85,8.94 3.05,9.14 3.05,13.82 v2.64,14.22
VCC  (via drill 0.51)
  Top 0.203: J1.9 24.74,2.23 33.12,2.23 33.73,1.63 34.95,1.63 35.76,2.44 35.76,3.28 J1.12
  Top 0.254: C9.1 8.7,28.4 U2.18 10.87,28.4 10.95,28.47 | U2.15 11.19,29.86 10.95,29.62 10.95,28.47 | 10.95,28.47 10.95,27.41 11.2,27.15 13.21,27.15 13.44,27.38 13.44,27.74 13.6,27.9 U2.7 | U4.25 32.23,31.21 v32.72,31.7 | J1.12 34.87,4.34 33.12,6.1 33.12,10.77 37.59,15.24 37.59,20.05 37.45,20.18 | U4.30 29.73,31.56 v29.87,31.7 | J1.4 29.84,15.88 31.11,14.61 J1.5 31.75,14.07 33.53,15.85 33.53,18.29 33.93,18.69 35.97,18.69 36.37,19.1 C19.1 | U4.16 32.83,25.69 v33.33,25.2
  Top 0.406: C8.1 4.94,28.72 4.06,27.84 v4.06,25.2 4.12,25.15 ISP1.2 4.57,21.03 5.49,20.12 5.49,17.68 v5.89,17.27 | v13.21,13.82 13.23,13.8 U1.27 13.23,11.56 13.61,11.18 C14.1 | v33.33,25.2 33.53,24.99 C22.1 | C19.1 37.45,20.18 37.8,20.52 v37.8,21.13 | U1.32 17.23,13.25 16.46,14.02 v16.26,14.02 | U1.4 v16.87,16.26
  Top 0.813: C8.1 C9.1
  Bottom 0.406: C23.1 C24.1 v29.87,31.7 | C23.1 v32.72,31.7 | v5.89,17.27 6.71,16.46 6.71,13.01 7.72,11.99 9.96,11.99 10.16,11.79 10.97,11.79 11.18,11.99 12.8,11.99 13.21,12.39 v13.21,13.82 13.21,15.56 C12.1 | C11.1 16.14,18.49 20.52,18.49 21.54,19.51 22.76,19.51 24.18,20.93 26.62,20.93 27.84,22.15 27.84,23.77 28.45,24.38 32.51,24.38 v33.33,25.2 33.53,25.2 35.36,27.03 | C12.1 16.04,14.02 v16.26,14.02 | C12.1 C11.1 | 3.66,25.2 v4.06,25.2 3.25,25.2 3.15,25.3 JP1.4 | C11.1 15.78,16.87 16.26,16.87 v16.87,16.26 | v37.8,21.13 37.8,26.21 36.98,27.03 35.36,27.03 | C23.1 33.87,33.19 34.54,32.51 34.54,27.84 35.36,27.03
XTAL1  (via drill 0.51)
  Top 0.203: v17.48,5.89 17.41,5.96 Y2.1 15.83,6.89 16.05,7.11 16.87,7.11 17.27,7.52 17.27,8.13 19.3,10.16 19.3,13.01 18.72,13.59 U1.1
  Bottom 0.203: C15.1 17.21,6.16 v17.48,5.89
XTAL2  (via drill 0.51)
  Top 0.203: U1.2 19.48,14.66 19.71,14.43 19.71,9.55 19.51,9.35 19.51,8.28 Y2.3 18.42,8.26 18.09,7.92 v18.09,7.11
  Bottom 0.203: C16.1 18.43,8.06 18.09,7.72 v18.09,7.11

### Text on the board
_tsilk: FB 2012 | avr-nrf | rev0 | _ | UART | ISP | _ | - | lo | + | hi | TX | C | RX | B | St | A